# Altium schematic sheet Sheet11.SchDoc: solar-powered-remote-water-level-relay
size 419 x 297 mm; Date: 2026/06/29; Author: forlook88@gmail.com; Revision: 0; SheetNumber: 11; SheetTotal: 11
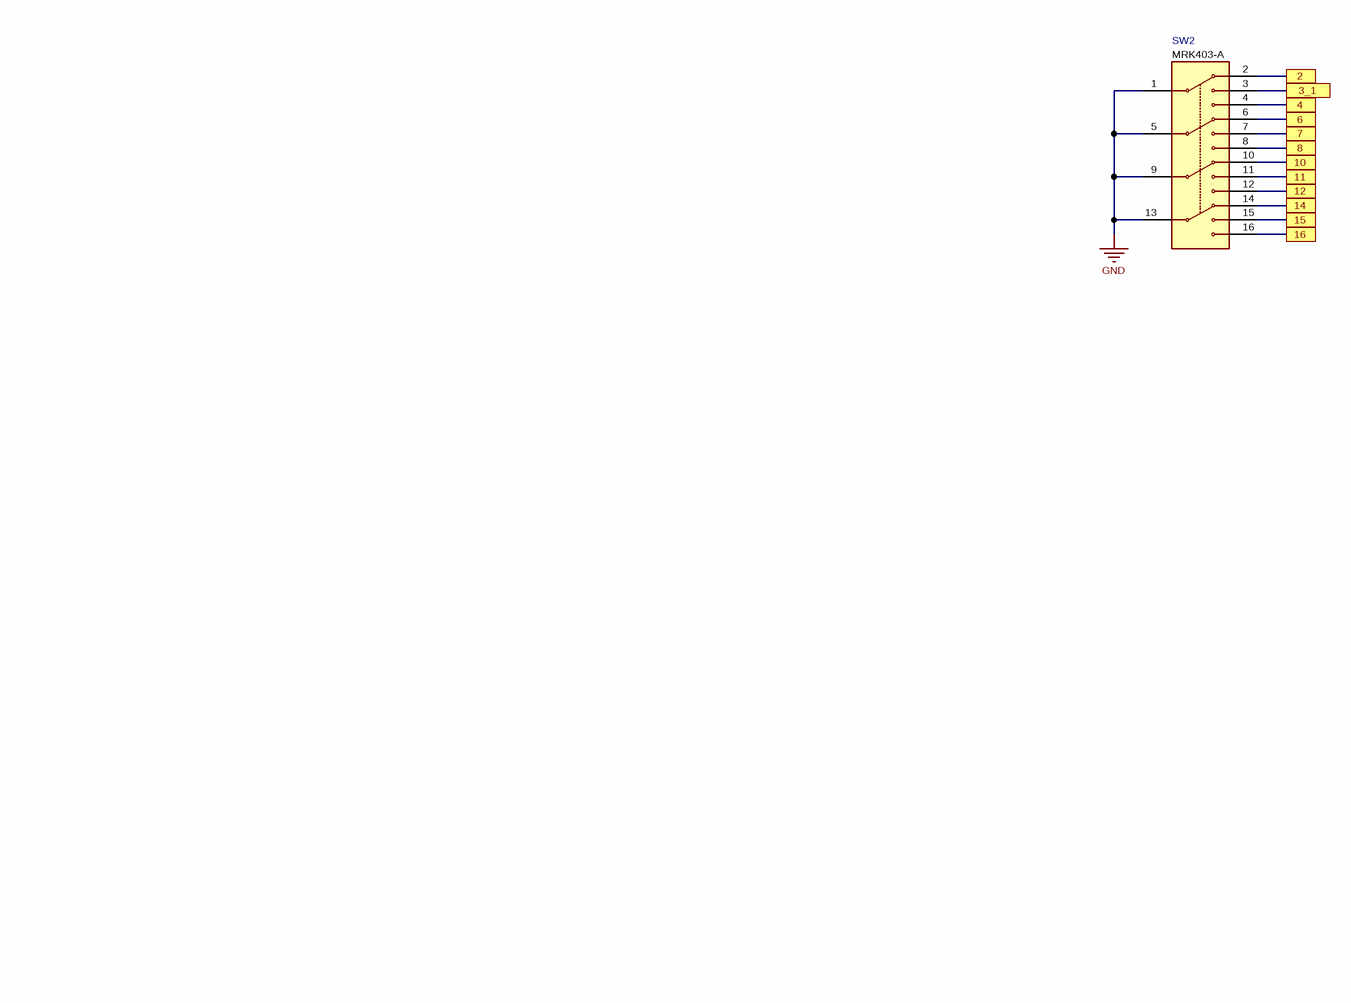
[diagram p0: Sheet11.SchDoc]

## Parts
SW2  value MRK403-A

## Ports
2, 3_1, 4, 6, 7, 8, 10, 11, 12, 14, 15, 16

## Nets
GND: SW2.1 SW2.5 SW2.9 SW2.13
2: SW2.2 ; port 2
3_1: SW2.3 ; port 3_1
4: SW2.4 ; port 4
6: SW2.6 ; port 6
7: SW2.7 ; port 7
8: SW2.8 ; port 8
10: SW2.10 ; port 10
11: SW2.11 ; port 11
12: SW2.12 ; port 12
14: SW2.14 ; port 14
15: SW2.15 ; port 15
16: SW2.16 ; port 16

## Notes on the sheet
- Document Name:
- Project Name:
- Sheet Name:
- Sheet Number:
- Author:
- CELUS Design Platform electronic designs are machine-generated drafts and require verification by qualified specialists.
- of
- Revision:
- Date:
- By using these designs, you agree to the CELUS Terms of Use: https://www.celus.io/terms-of-use

## Library data of the parts
SW2 = (no symbol name): Manufacturer: NKK Switches; Manufacturer Part Number: MRK403-A